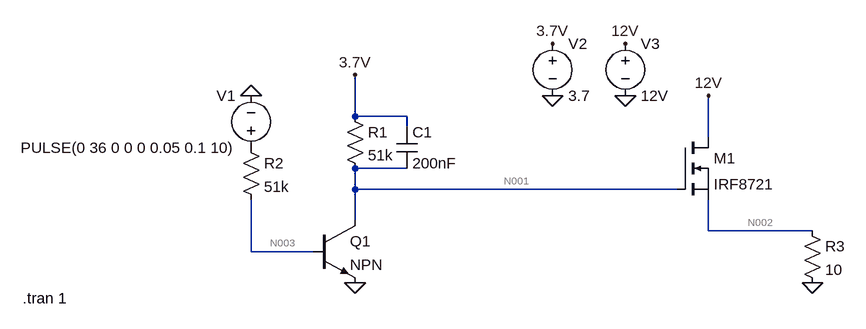
[diagram p0: schematic Draft2.asc]
Draft2.asc, the LTspice schematic file:
Version 4
SHEET 1 1016 680
WIRE 256 16 256 -48
WIRE 336 16 256 16
WIRE 336 32 336 16
WIRE 800 48 800 -16
WIRE 336 96 256 96
WIRE 256 128 256 96
WIRE 752 128 256 128
WIRE 256 176 256 128
WIRE 800 192 800 144
WIRE 960 192 800 192
WIRE 96 224 96 144
WIRE 192 224 96 224
FLAG 256 272 0
FLAG 256 -48 3.7V
FLAG 96 -16 0
FLAG 560 -16 0
FLAG 560 -96 3.7V
FLAG 800 -16 12V
FLAG 672 -16 0
FLAG 672 -96 12V
FLAG 960 272 0
SYMBOL npn 192 176 R0
SYMATTR InstName Q1
SYMBOL res 240 0 R0
SYMATTR InstName R1
SYMATTR Value 51k
SYMBOL res 80 48 R0
SYMATTR InstName R2
SYMATTR Value 51k
SYMBOL voltage 96 80 R180
WINDOW 0 24 96 Left 2
WINDOW 3 24 16 Left 2
WINDOW 123 0 0 Left 2
WINDOW 39 0 0 Left 2
SYMATTR InstName V1
SYMATTR Value PULSE(0 36 0 0 0 0.05 0.1 10)
SYMBOL voltage 560 -112 R0
WINDOW 123 0 0 Left 2
WINDOW 39 0 0 Left 2
SYMATTR InstName V2
SYMATTR Value 3.7
SYMBOL cap 320 32 R0
SYMATTR InstName C1
SYMATTR Value 200nF
SYMBOL nmos 752 48 R0
SYMATTR InstName M1
SYMATTR Value IRF8721
SYMBOL voltage 672 -112 R0
WINDOW 123 0 0 Left 2
WINDOW 39 0 0 Left 2
SYMATTR InstName V3
SYMATTR Value 12V
SYMBOL res 944 176 R0
SYMATTR InstName R3
SYMATTR Value 10
TEXT -256 296 Left 2 !.tran 1

The netlist it stands for:
* Draft2.asc
Q1 N001 N003 0 0 NPN
R1 3.7V N001 51k
R2 P001 N003 51k
V1 P001 0 PULSE(0 36 0 0 0 0.05 0.1 10)
V2 3.7V 0 3.7
C1 3.7V N001 200nF
M1 12V N001 N002 N002 IRF8721
V3 12V 0 12V
R3 N002 0 10
.model NPN NPN
.model PNP PNP
.lib standard.bjt
.model NMOS NMOS
.model PMOS PMOS
.lib standard.mos
.tran 1
.backanno
.end

* Results of the author's LTspice run, read from the files saved beside the schematic
* Operating Point, zero values left out:
*   V(n001) = 3.7 V
*   V(n003) = 188.7 nV
*   V(3.7v) = 3.7 V
*   V(12v) = 12 V
*   V(n002) = 1.448 V
*   Ic(Q1) = 3.7 pA
*   Ib(Q1) = -3.7 pA
*   Id(M1) = 144.8 mA
*   Is(M1) = -144.8 mA
*   I(R3) = 144.8 mA
*   I(R2) = -3.7 pA
*   I(R1) = 3.7 pA
*   I(V3) = -144.8 mA
*   I(V2) = -3.7 pA
*   I(V1) = 3.7 pA
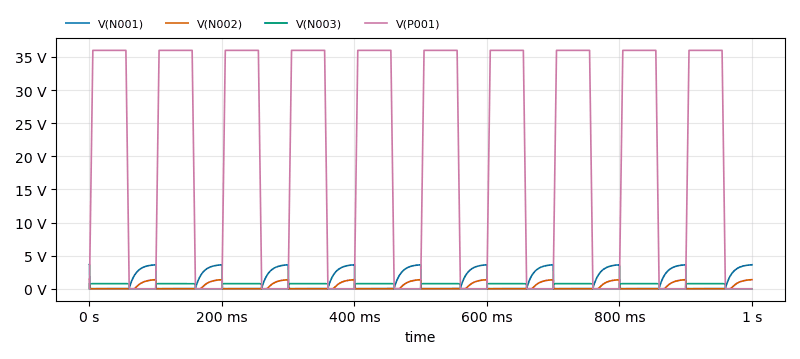
[diagram p1: Transient Analysis of Draft2.asc, plotted from the saved traces]
* Transient Analysis, 1 run:
*   V(N001): min 19.27 mV, max 3.7 V, average 1.141 V, rms 1.871 V, last 3.628 V
*   V(N002): min -191.9 µV, max 1.448 V, average 316.6 mV, rms 597.9 mV, last 1.379 V
*   V(N003): min 0 V, max 811.6 mV, average 467.1 mV, rms 603.5 mV, last 185.1 nV
*   V(P001): min 0 V, max 36 V, average 19.8 V, rms 26.3 V, last 0 V